# Altium schematic sheet DMP_SEM_MCU.SchDoc: Target MCU
size A3; Organization: Microchip; Address1: Vestre Rosten 79; Address2: N-7075 TILLER; Address3: NORWAY; DocumentNumber: A09-2748; Revision: 11; SheetNumber: 2; SheetTotal: 4; DrawnBy: Microchip Norway; Engineer: HN; PageSetup: Record=PageOptions|CenterHorizontal=True|CenterVertical=True|PrintScale=1.01|XCorrection=1.00|YCorrection=1.00|PrintKind=1|BorderSize=5000000|LeftOffset=0|BottomOffset=0|Orientation=2|PaperLength=1000|PaperWidth=1000|Scale=100|PaperSource=7|PrintQuality=-4|MediaType=1|DitherType=10|PaperKind=A3 (297 x 420 mm)|PrintScaleMode=1; ProjectTitle: SAM E54 Xplained Pro; PCBNumber: A08-2643; PCBRevision: 4; ProjectName: SAM E54 Xplained Pro
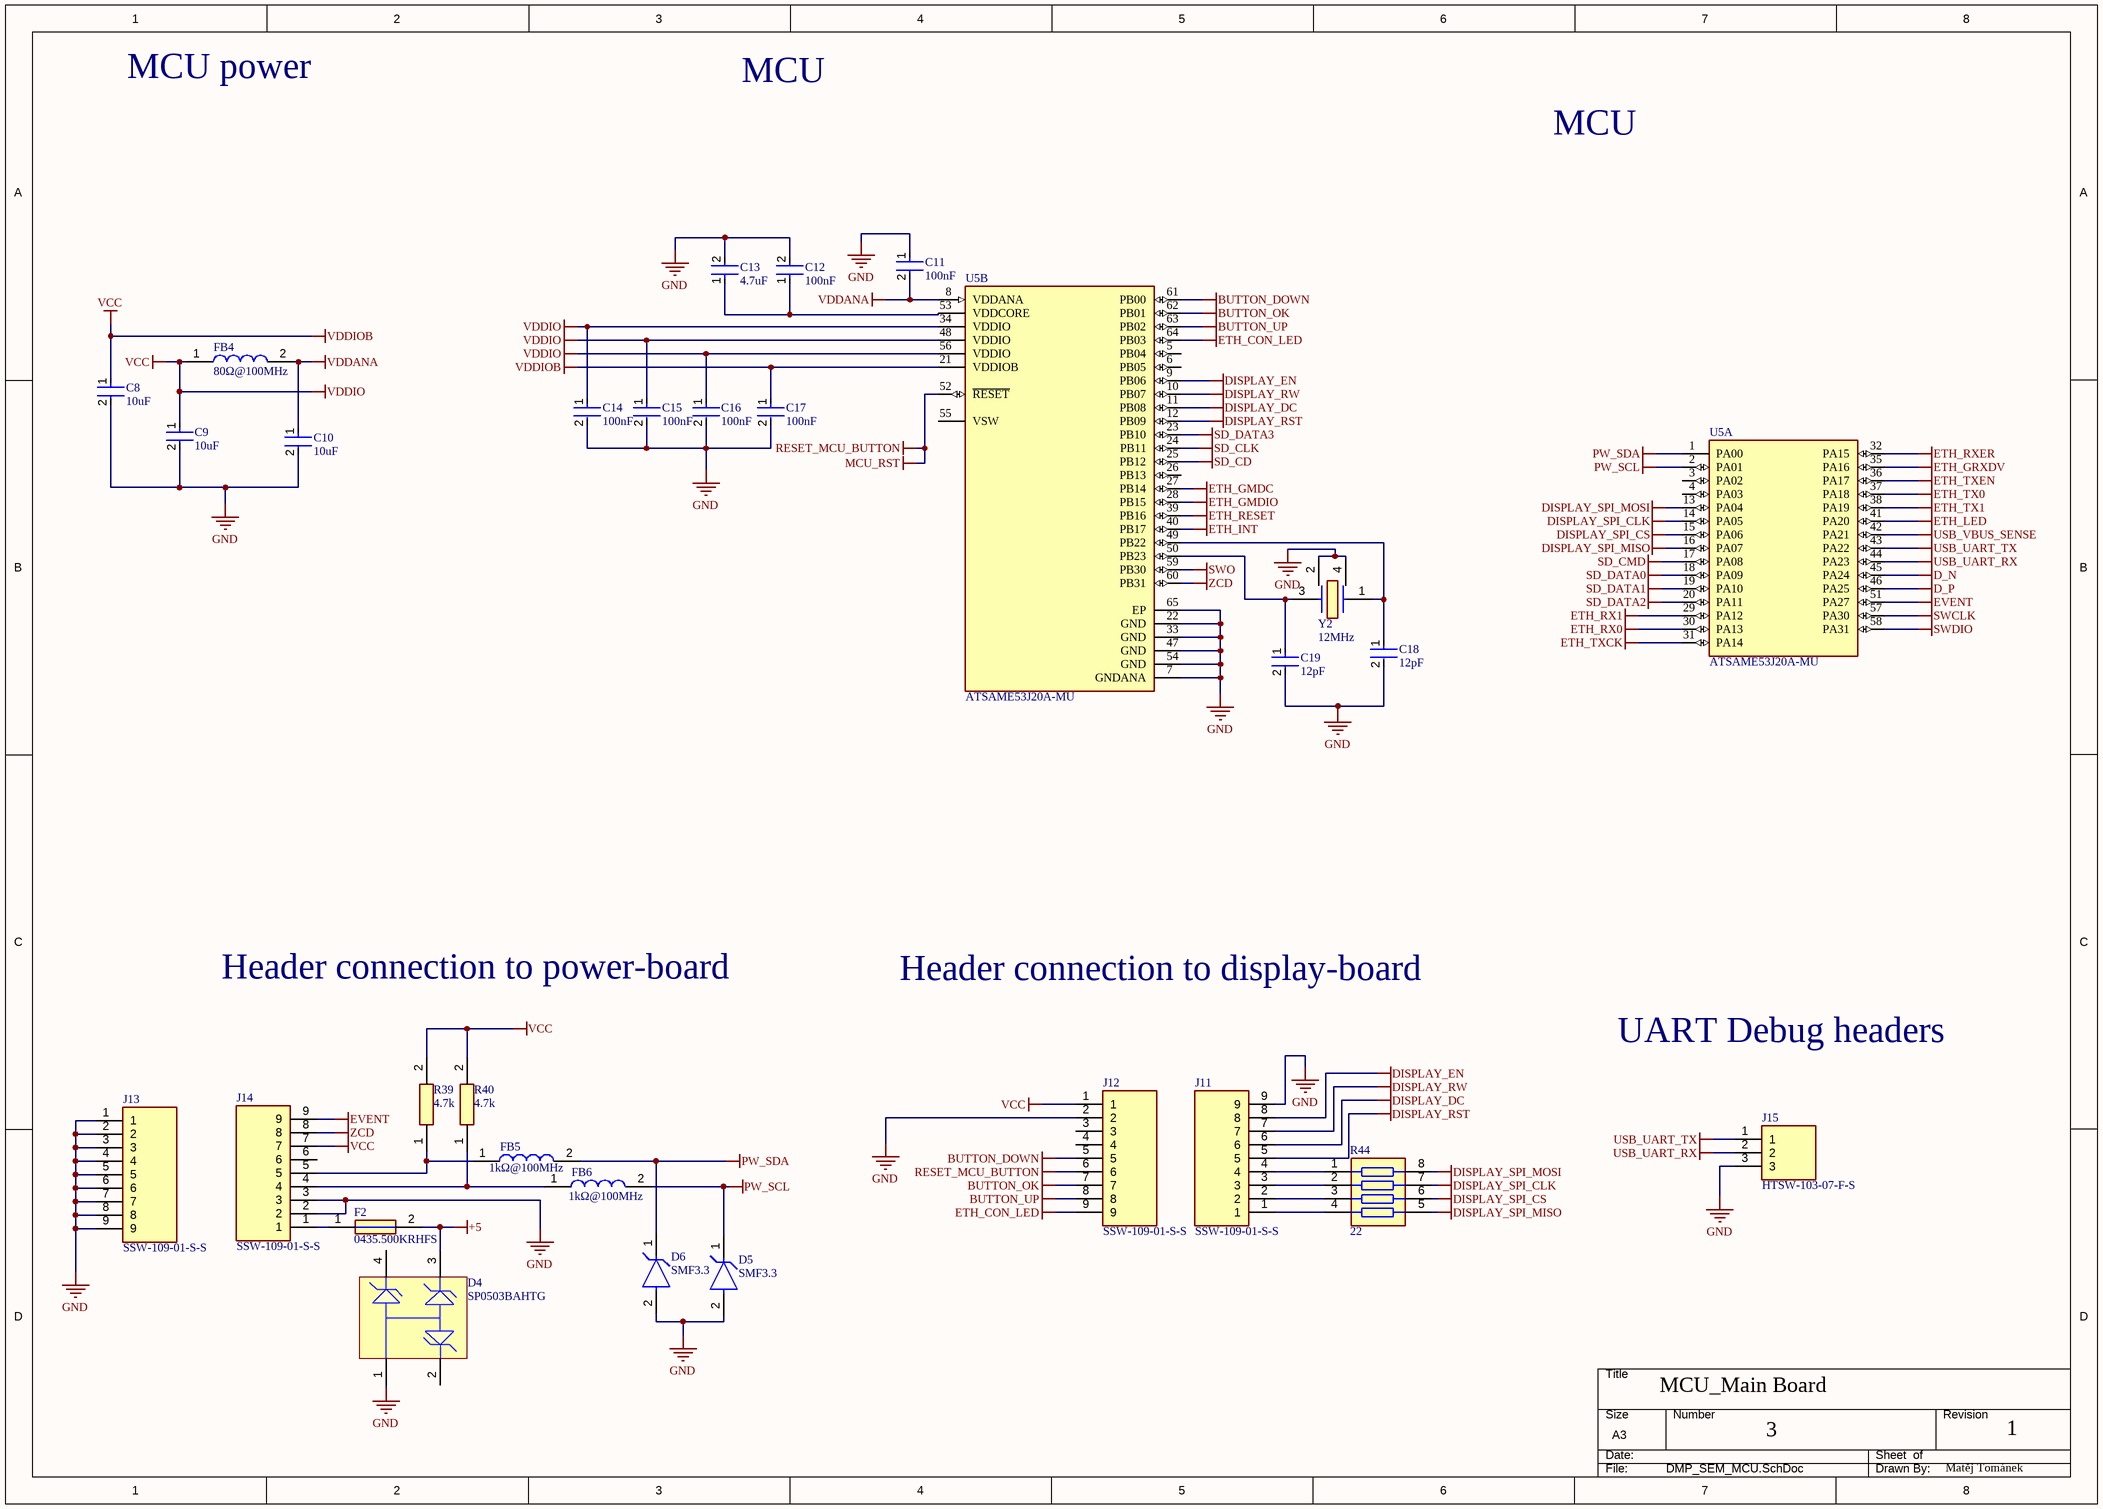
[diagram p0: DMP_SEM_MCU.SchDoc]

## Parts
C8  10uF  [CL10A106KO8NQNC]
C9  10uF  [CL10A106KO8NQNC]
C10  10uF  [CL10A106KO8NQNC]
C11  100nF  [CL05B104KO5NNNC]
C12  100nF  [CL05B104KO5NNNC]
C13  4.7uF  [CL05A475KP5NRNC]
C14  100nF  [CL05B104KO5NNNC]
C15  100nF  [CL05B104KO5NNNC]
C16  100nF  [CL05B104KO5NNNC]
C17  100nF  [CL05B104KO5NNNC]
C18  12pF  [GRM1555C1H120JA01D]
C19  12pF  [GRM1555C1H120JA01D]
D4  SP0503BAHTG  [SP0503BAHTG]
D5  SMF3.3  [SMF3.3]
D6  SMF3.3  [SMF3.3]
F2  0435.500KRHFS  [0435.500KRHFS]
FB4  80Ω@100MHz  [BLM15PD800SN1D]
FB5  1kΩ@100MHz  [BLM15BD102SN1D]
FB6  1kΩ@100MHz  [BLM15BD102SN1D]
J11  SSW-109-01-S-S  [SSW-109-01-S-S]
J12  SSW-109-01-S-S  [SSW-109-01-S-S]
J13  SSW-109-01-S-S  [SSW-109-01-S-S]
J14  SSW-109-01-S-S  [SSW-109-01-S-S]
J15  HTSW-103-07-F-S  [HTSW-103-07-F-S]
R39  4.7k  [ERJ-3EKF4701V]
R40  4.7k  [ERJ-3EKF4701V]
R44  22  [CAY10-220J4LF]
U5  ATSAME53J20A-MU  [FP-PA-IPC_A]  (parts A,B of 2)
Y2  12MHz  [ABM8W-12.0000MHZ-6-B1U-T3]

## Nets
+5: D4.3 F2.2
BUTTON_DOWN: J12.5 U5.61(PB00)
BUTTON_OK: J12.7 U5.62(PB01)
BUTTON_UP: J12.8 U5.63(PB02)
D_N: U5.45(PA24)
D_P: U5.46(PA25)
DISPLAY_DC: J11.6 U5.11(PB08)
DISPLAY_EN: J11.8 U5.9(PB06)
DISPLAY_RST: J11.5 U5.12(PB09)
DISPLAY_RW: J11.7 U5.10(PB07)
DISPLAY_SPI_CLK: R44.7 U5.14(PA05)
DISPLAY_SPI_CS: R44.6 U5.15(PA06)
DISPLAY_SPI_MISO: R44.5 U5.16(PA07)
DISPLAY_SPI_MOSI: R44.8 U5.13(PA04)
ETH_CON_LED: J12.9 U5.64(PB03)
ETH_GMDC: U5.27(PB14)
ETH_GMDIO: U5.28(PB15)
ETH_GRXDV: U5.35(PA16)
ETH_INT: U5.40(PB17)
ETH_LED: U5.41(PA20)
ETH_RESET: U5.39(PB16)
ETH_RX0: U5.30(PA13)
ETH_RX1: U5.29(PA12)
ETH_RXER: U5.32(PA15)
ETH_TX0: U5.37(PA18)
ETH_TX1: U5.38(PA19)
ETH_TXCK: U5.31(PA14)
ETH_TXEN: U5.36(PA17)
EVENT: J14.9 U5.51(PA27)
GND: C8.2 C9.2 C10.2 C11.1 C12.2 C13.2 C14.2 C15.2 C16.2 C17.2 C18.2 C19.2 D4.1 D5.2(A) D6.2(A) J11.9 J12.2 J13.1 J13.2 J13.3 J13.4 J13.5 J13.6 J13.7 J13.8 J13.9 J14.2 J14.3 J15.3 U5.7(GNDANA) U5.22(GND) U5.33(GND) U5.47(GND) U5.54(GND) U5.65(EP) Y2.2 Y2.4
MCU_RST: J12.6 U5.52(~{RESET})  [also labelled RESET_MCU_BUTTON]
PW_SCL: D5.1(C) FB6.2 U5.2(PA01)
PW_SDA: D6.1(C) FB5.2 U5.1(PA00)
SD_CD: U5.25(PB12)
SD_CLK: U5.24(PB11)
SD_CMD: U5.17(PA08)
SD_DATA0: U5.18(PA09)
SD_DATA1: U5.19(PA10)
SD_DATA2: U5.20(PA11)
SD_DATA3: U5.23(PB10)
SWCLK: U5.57(PA30)
SWDIO: U5.58(PA31)
SWO: U5.59(PB30)
USB_UART_RX: J15.2 U5.44(PA23)
USB_UART_TX: J15.1 U5.43(PA22)
USB_VBUS_SENSE: U5.42(PA21)
VCC: C8.1 C9.1 C14.1 C15.1 C16.1 C17.1 FB4.1 J12.1 J14.7 R39.2 R40.2 U5.21(VDDIOB) U5.34(VDDIO) U5.48(VDDIO) U5.56(VDDIO)  [also labelled VDDIO, VDDIOB]
VDDANA: C10.1 C11.2 FB4.2 U5.8(VDDANA)
ZCD: J14.8 U5.60(PB31)
NetC12_1: C12.1 C13.1 U5.53(VDDCORE)
NetC18_1: C18.1 U5.49(PB22) Y2.1
NetC19_1: C19.1 U5.50(PB23) Y2.3
NetF2_1: F2.1 J14.1
NetFB5_1: FB5.1 J14.5 R39.1
NetFB6_1: FB6.1 J14.4 R40.1
NetJ11_1: J11.1 R44.4
NetJ11_2: J11.2 R44.3
NetJ11_3: J11.3 R44.2
NetJ11_4: J11.4 R44.1

Not connected (* = marked no-connect by the designer): D4 2 4; J12 3 4; J14 6; U5 3(PA02) 4(PA03) 5(PB04) 6(PB05) 26(PB13) 55(VSW)

## Notes on the sheet
- MCU power
- MCU
- Header connection to power-board
- Header connection to display-board
- UART Debug headers
- MCU_Main Board
- 3
- 1
- Matěj Tománek
- DWG. NO.
- REV.
- SHT.
- THIS DOCUMENT AND THE DATA DISCLOSED HEREIN OR HEREWITH IS THE PROPERTY OF ALTIUM LIMITED AND MAY BE FREELY DISTRIBUTED IN WHOLE. NO RIGHTS ARE RESERVED OR EXPRESS OR IMPLIED WARANTEE GIVEN.
- REVISION
- DESCRIPTION
- DATE
- APPROVED
- ENG:
- APPROVALS
- PROJECT
- DSN:
- CHK:
- REFERENCE DOCUMENTS
- PROJECT REVISION:
- TITLE
- DOCUMENT REVISION:
- DESIGN ITEM:
- BOM:
- FAB DWG:
- PCB DWG:
- ASSY DWG:
- SCALE:
- SIZE
- B
- CAGE CODE
- FILE NAME
- DWG NO.
- SHEET
- OF
- REV

## Library data of the parts
C8-C10 = CL10A106KO8NQNC: Capacitor CL10A106KO8NQNC
C11 C12 C14-C17 = CL05B104KO5NNNC: Capacitor CL05B104KO5NNNC
C13 = CL05A475KP5NRNC: Capacitor CL05A475KP5NRNC
C18 C19 = GRM1555C1H120JA01D: Capacitor GRM1555C1H120JA01D
D4 = SP0503BAHTG: TVS Diodes SP0503BAHTG
D5 D6 = SMF3.3: TVS diode SMF3.3
F2 = 0435.500KRHFS: Fuse 0435.500KRHFS
FB4 = BLM15PD800SN1D: Chip Ferrite Bead BLM15PD800SN1D
FB5 FB6 = BLM15BD102SN1D: Chip Ferrite Bead BLM15BD102SN1D
J11-J14 = SSW-109-01-S-S: Connector SSW-109-01-S-S
J15 = HTSW-103-07-F-S: Headers HTSW-103-07-F-S
R39 R40 = ERJ-3EKF4701V: Resistor ERJ-3EKF4701V
R44 = CAY10-220J4LF: Resistor array CAY10-220J4LF
U5 = CMP-06276-000633-1: IC MCU 32BIT 1MB FLASH 64VQFN; Core Architecture: ARM; Frequency: 120MHz; Oscillator Type: Internal; Number of I/Os: 51; Peripherals: Brown-out Detect/Reset; Interface: I2C; Case/Package: VQFN; Packaging: Tray; Memory Type: FLASH; Min Operating Temperature: -40°C; Max Operating Temperature: 85°C; Memory Size: 1MB
Y2 = ABM8W-12.0000MHZ-6-B1U-T3: Crystal ABM8W-12.0000MHZ-6-B1U-T3